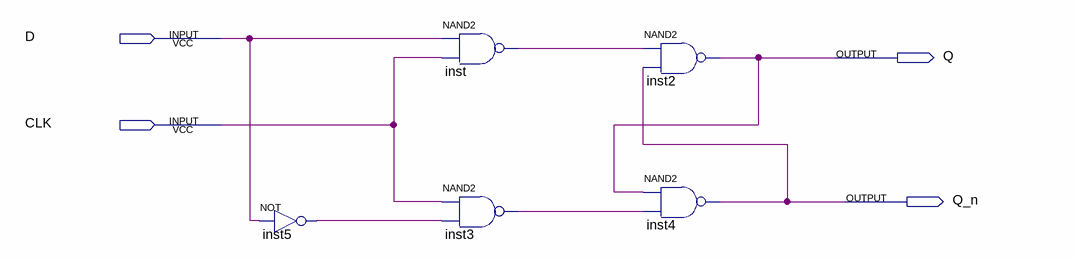
[diagram p0: schematic sheet]
// Quartus schematic dwave.bdf as structural Verilog: 5 symbols, 4 pins
module dwave (
  input  D,
  input  CLK,
  output Q,
  output Q_n
);

  wire inst3_out, inst5_out, inst_out;

  not inst5 (inst5_out, D);
  nand inst (inst_out, D, CLK);
  nand inst3 (inst3_out, CLK, inst5_out);
  nand inst2 (Q, inst_out, Q_n);
  nand inst4 (Q_n, Q, inst3_out);
endmodule
